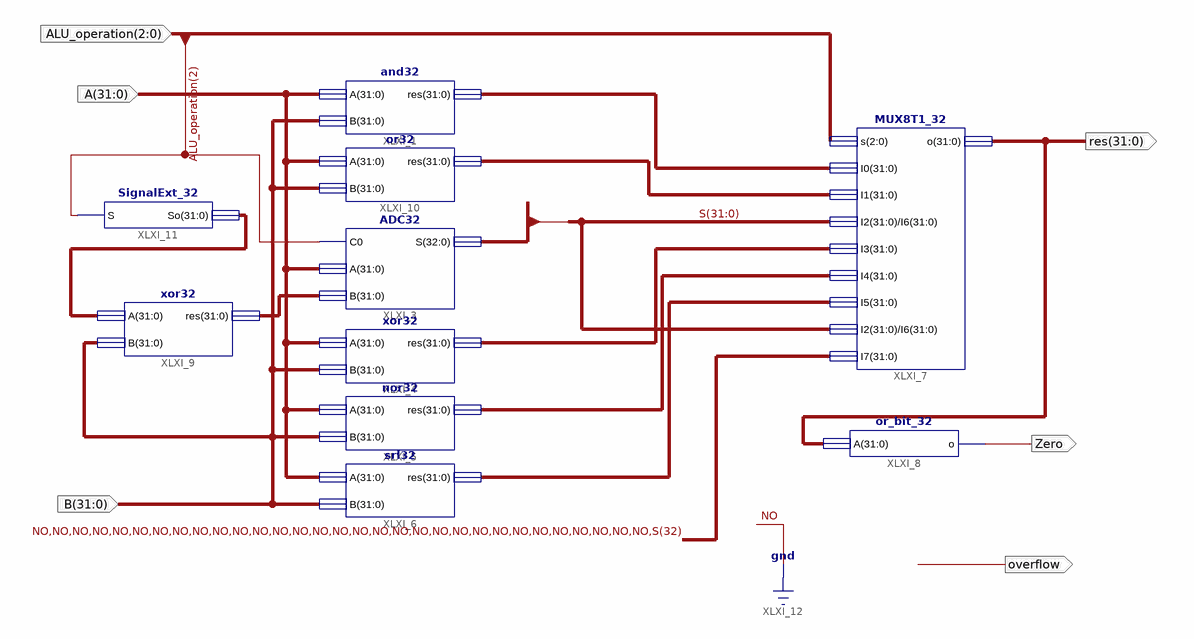
[diagram p0: schematic sheet 1]
// Xilinx ISE schematic ALU_32.sch (kintex7) as structural Verilog: 10 symbols, 6 ports
module ALU_32 (
  input  [2:0] ALU_operation,
  input  [31:0] A,
  input  [31:0] B,
  output [31:0] res,
  output Zero,
  output overflow
);

  wire [31:0] XLXN_14, XLXN_16, XLXN_17, XLXN_18, XLXN_20, XLXN_21, XLXN_22;
  wire [32:0] S;

  and32 XLXI_1 (.A(A), .B(B), .res(XLXN_17));
  ADC32 XLXI_3 (.C0(ALU_operation[2]), .A(A), .B(XLXN_16), .S(S));
  xor32 XLXI_4 (.A(A), .B(B), .res(XLXN_20));
  nor32 XLXI_5 (.A(A), .B(B), .res(XLXN_21));
  srl32 XLXI_6 (.A(A), .B(B), .res(XLXN_22));
  MUX8T1_32 XLXI_7 (
    .s(ALU_operation), .I0(XLXN_17), .I1(XLXN_18), .I2(S[31:0]), .I3(XLXN_20), .I4(XLXN_21), .I5(XLXN_22),
    .I6(S[31:0]), .I7({{31{1'b0}}, S[32]}), .o(res));
  or_bit_32 XLXI_8 (.A(res), .o(Zero));
  xor32 XLXI_9 (.A(XLXN_14), .B(B), .res(XLXN_16));
  or32 XLXI_10 (.A(A), .B(B), .res(XLXN_18));
  SignalExt_32 XLXI_11 (.S(ALU_operation[2]), .So(XLXN_14));
endmodule
